# EAGLE schematic front (EAGLE 7.7.0)
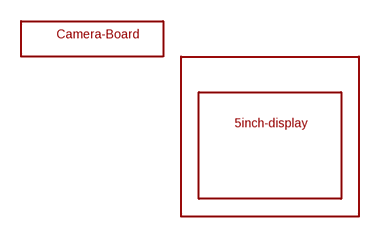
[diagram p0: schematic, sheet 1]

## Parts
U$2  CAMERA-BOARD  [CAMERA-BOARD]
U$3  5INCH-DISPLAY-GUIDENOHOLE  [5INCH-DISP-NOHOLE]

## Library data of the parts
U$2 = 0-chirimen:CAMERA-BOARD
U$3 = 0-chirimen:5INCH-DISPLAY-GUIDE